# Altium schematic sheet schematic.SchDoc
size A4; SheetNumber: 6; SheetTotal: 29
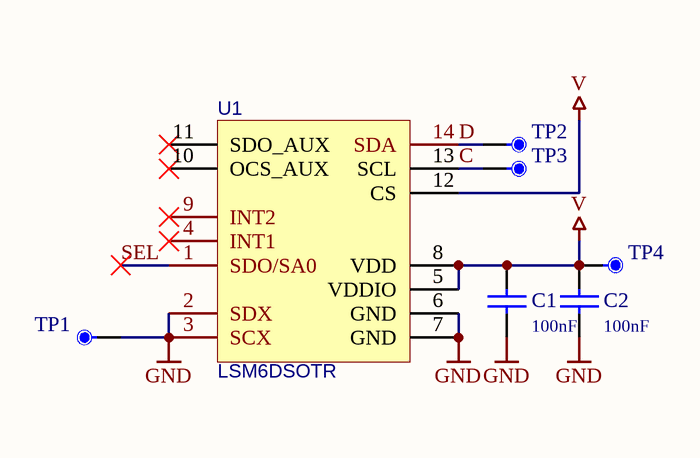
[diagram p0: schematic.SchDoc]

## Parts
C1  100nF  [C0402]
C2  100nF  [C0402]
TP1  (no value)  [TP2030_SMD]  (no BOM)
TP2  (no value)  [TP2030_SMD]  (no BOM)
TP3  (no value)  [TP2030_SMD]  (no BOM)
TP4  (no value)  [TP2030_SMD]  (no BOM)
U1  LSM6DSOTR  [LGA-14_L3.0-W2.5-P0.50-TL]

## Nets
GND: C1.1 C2.1 TP1.1 U1.2(SDX) U1.3(SCX) U1.6(GND) U1.7(GND)
V: C1.2 C2.2 TP4.1 U1.5(VDDIO) U1.8(VDD) U1.12(CS)
C: TP3.1 U1.13(SCL)
D: TP2.1 U1.14(SDA)
SEL: U1.1(SDO/SA0)

Not connected (* = marked no-connect by the designer): U1 4(INT1)* 9(INT2)* 10(OCS_AUX)* 11(SDO_AUX)*

## Library data of the parts
C1 C2 = CAP: P/N: CC0402KRX7R9BB104; LCSC part number: C131394
TP1-TP4 = TP_Dup1
U1 = LSM6DSOTR: LCSC part number: C2655100; P/N: LSM6DSOTR